# Altium schematic sheet SYZYGY_BOARD_CONN.SchDoc: ARDUINO_SYZGY
size 420 x 297 mm; DrawnBy: Orhun Dabak; Revision: 1.0; SheetNumber: 7; SheetTotal: 8
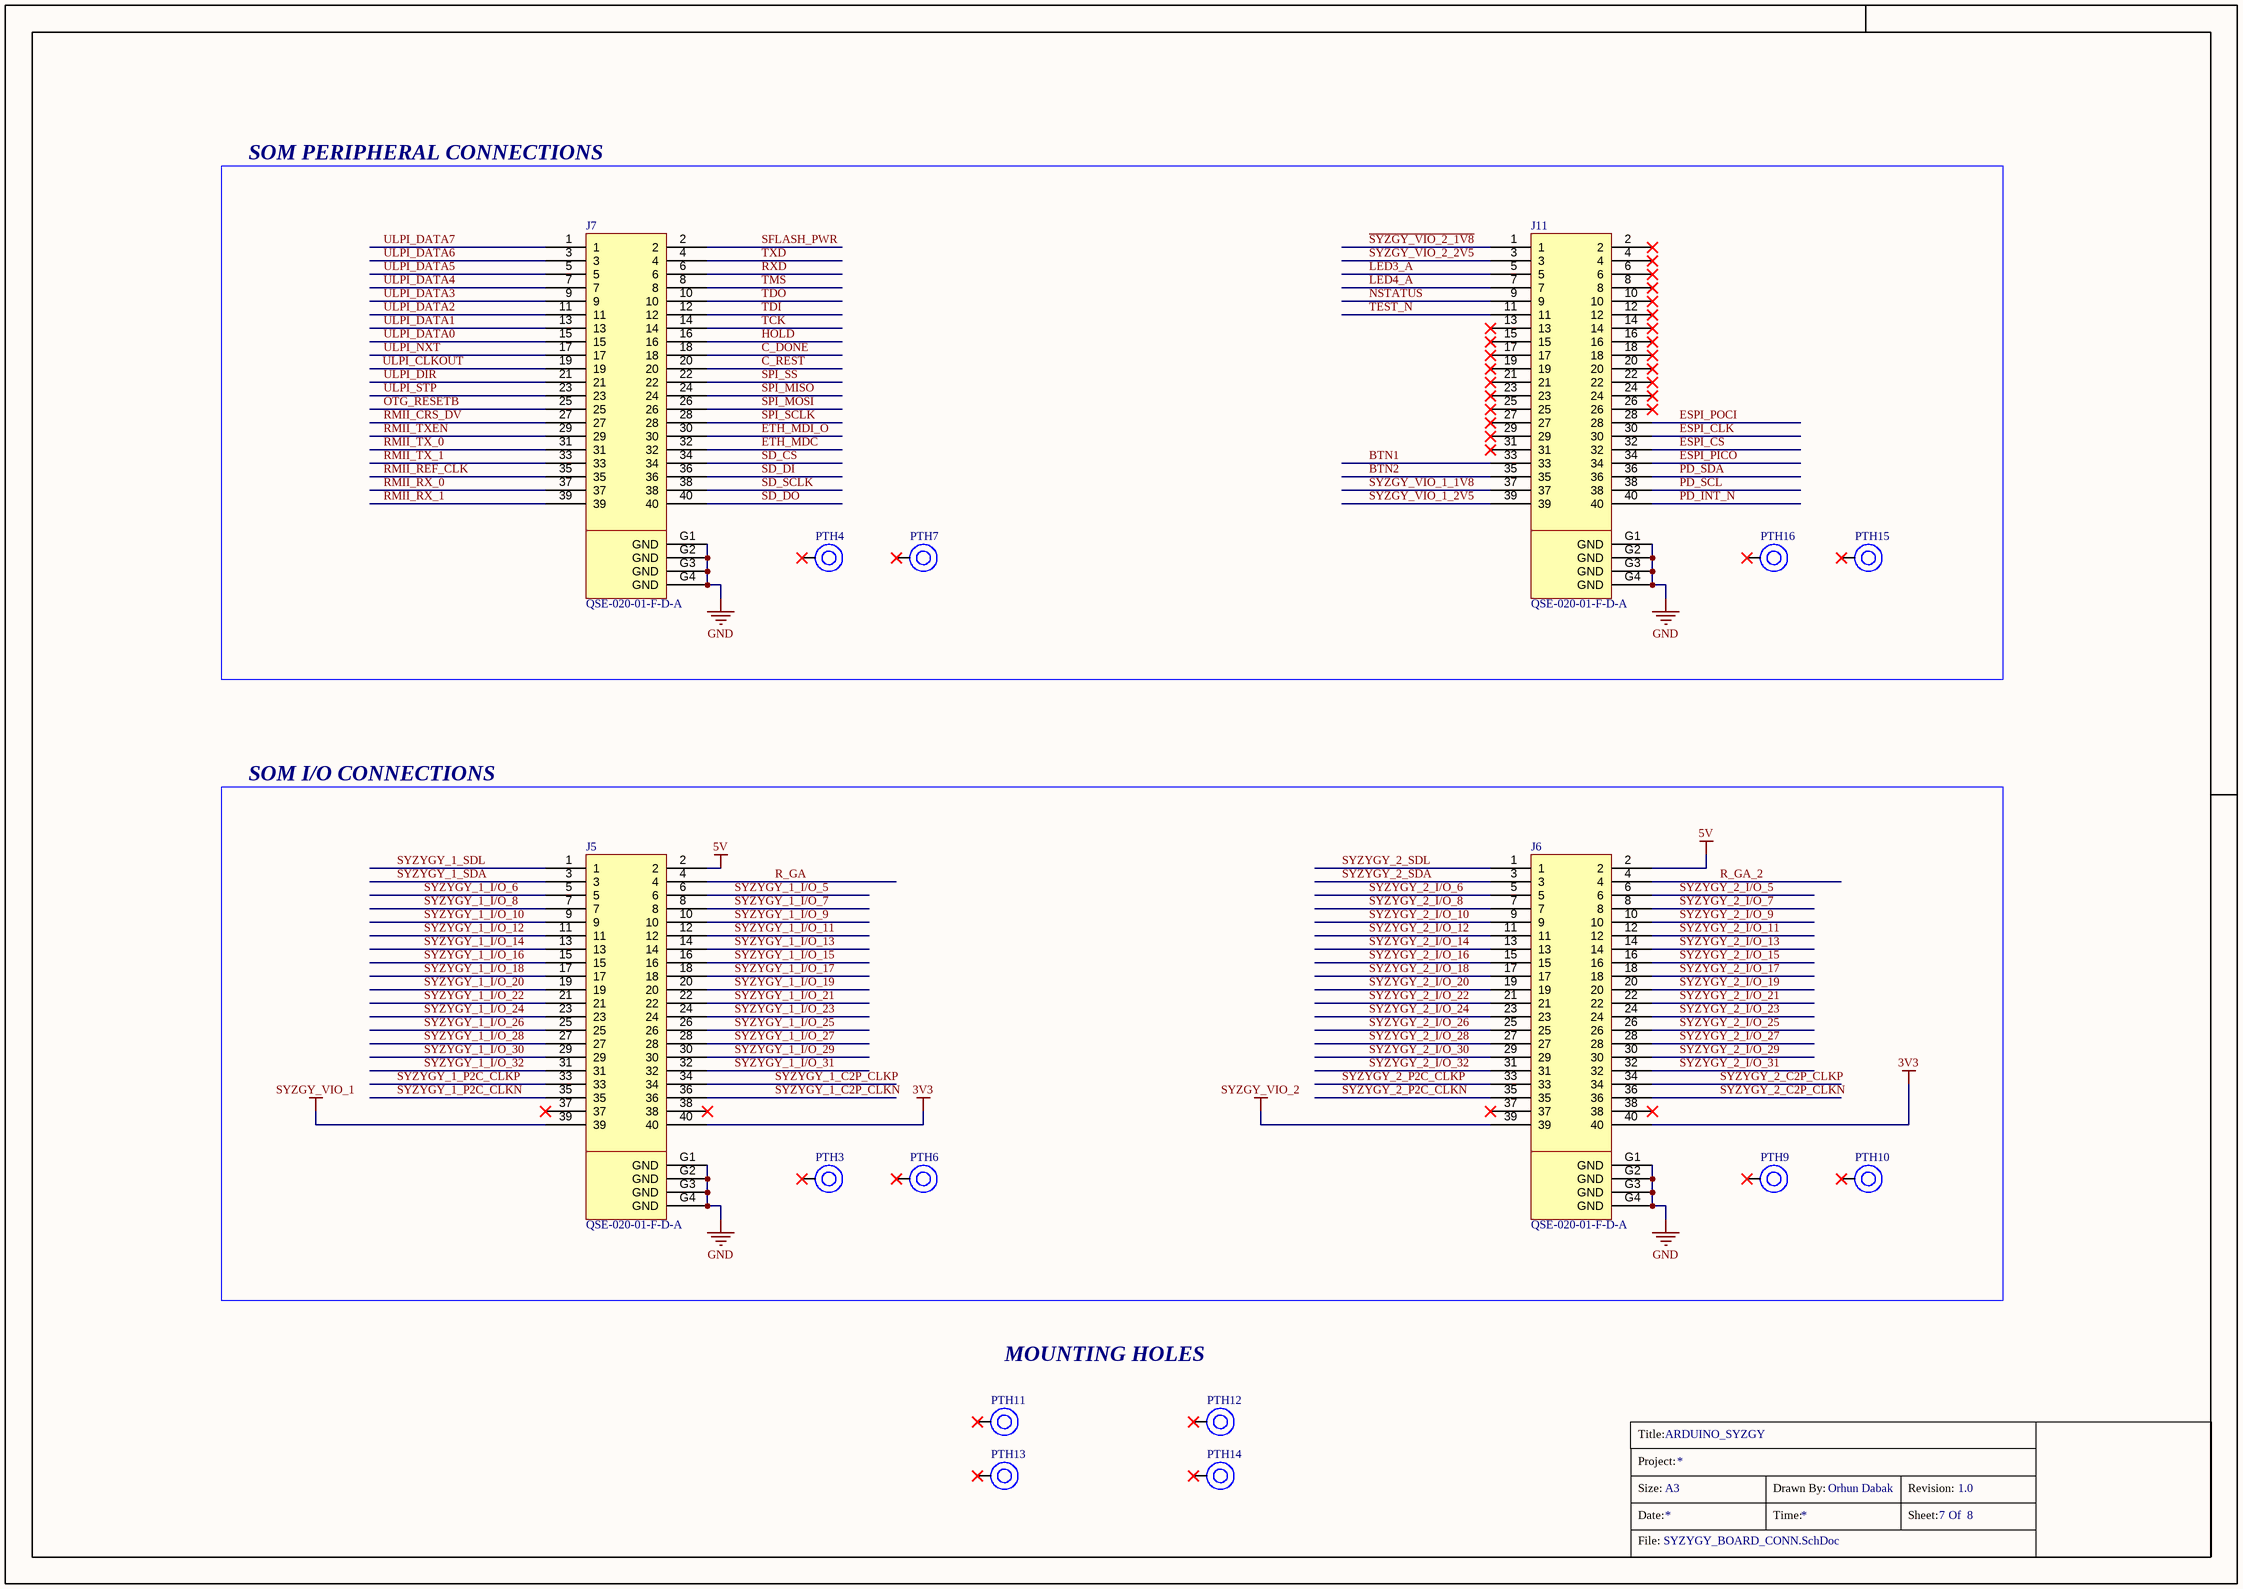
[diagram p0: SYZYGY_BOARD_CONN.SchDoc]

## Parts
?  (no value)  (graphical)
J5  QSE-020-01-F-D-A  [QSE-020-01-F-D-A-Footprint-2]
J6  QSE-020-01-F-D-A  [QSE-020-01-F-D-A-Footprint-2]
J7  QSE-020-01-F-D-A  [QSE-020-01-F-D-A-Footprint-2]
J11  QSE-020-01-F-D-A  [QSE-020-01-F-D-A-Footprint-2]
PTH3  SYZYGY_PCB_Mounting_Hole  [SYZYGY_PCB_Mounting_Hole]  (value not drawn)  (no BOM)
PTH4  SYZYGY_PCB_Mounting_Hole  [SYZYGY_PCB_Mounting_Hole]  (value not drawn)  (mechanical)
PTH6  SYZYGY_PCB_Mounting_Hole  [SYZYGY_PCB_Mounting_Hole]  (value not drawn)  (no BOM)
PTH7  SYZYGY_PCB_Mounting_Hole  [SYZYGY_PCB_Mounting_Hole]  (value not drawn)  (mechanical)
PTH9  SYZYGY_PCB_Mounting_Hole  [SYZYGY_PCB_Mounting_Hole]  (value not drawn)  (mechanical)
PTH10  SYZYGY_PCB_Mounting_Hole  [SYZYGY_PCB_Mounting_Hole]  (value not drawn)  (mechanical)
PTH11  SYZYGY_PCB_Mounting_Hole  [SYZYGY_PCB_Mounting_Hole]  (value not drawn)  (no BOM)
PTH12  SYZYGY_PCB_Mounting_Hole  [SYZYGY_PCB_Mounting_Hole]  (value not drawn)  (no BOM)
PTH13  SYZYGY_PCB_Mounting_Hole  [SYZYGY_PCB_Mounting_Hole]  (value not drawn)  (no BOM)
PTH14  SYZYGY_PCB_Mounting_Hole  [SYZYGY_PCB_Mounting_Hole]  (value not drawn)  (no BOM)
PTH15  SYZYGY_PCB_Mounting_Hole  [SYZYGY_PCB_Mounting_Hole]  (value not drawn)  (no BOM)
PTH16  SYZYGY_PCB_Mounting_Hole  [SYZYGY_PCB_Mounting_Hole]  (value not drawn)  (no BOM)

## Blocks framed on the sheet
SOM PERIPHERAL CONNECTIONS: J7 J11 PTH4 PTH7 PTH15 PTH16
SOM I/O CONNECTIONS: J5 J6 PTH3 PTH6 PTH9 PTH10

## Nets
3V3: J5.40 J6.40
5V: J5.2 J6.2
GND: J5.G1(GND) J5.G2(GND) J5.G3(GND) J5.G4(GND) J6.G1(GND) J6.G2(GND) J6.G3(GND) J6.G4(GND) J7.G1(GND) J7.G2(GND) J7.G3(GND) J7.G4(GND) J11.G1(GND) J11.G2(GND) J11.G3(GND) J11.G4(GND)
SYZGY_VIO_1: J5.39
SYZGY_VIO_2: J6.39
BTN1: J11.33
BTN2: J11.35
C_DONE: J7.18
C_REST: J7.20
ESPI_CLK: J11.30
ESPI_CS: J11.32
ESPI_PICO: J11.34
ESPI_POCI: J11.28
ETH_MDC: J7.32
ETH_MDI_O: J7.30
HOLD: J7.16
LED3_A: J11.5
LED4_A: J11.7
NSTATUS: J11.9
OTG_RESETB: J7.25
PD_INT_N: J11.40
PD_SCL: J11.38
PD_SDA: J11.36
R_GA: J5.4
R_GA_2: J6.4
RMII_CRS_DV: J7.27
RMII_REF_CLK: J7.35
RMII_RX_0: J7.37
RMII_RX_1: J7.39
RMII_TX_0: J7.31
RMII_TX_1: J7.33
RMII_TXEN: J7.29
RXD: J7.6
~{SD_CS}: J7.34
~{SYZGY_VIO_1_1V8}: J11.37
~{SYZGY_VIO_1_2V5}: J11.39
~{SYZGY_VIO_2_1V8}: J11.1
~{SYZGY_VIO_2_2V5}: J11.3
SD_DI: J7.36
SD_DO: J7.40
SD_SCLK: J7.38
SFLASH_PWR: J7.2
SPI_MISO: J7.24
SPI_MOSI: J7.26
SPI_SCLK: J7.28
SPI_SS: J7.22
SYZYGY_1_C2P_CLKN: J5.36
SYZYGY_1_C2P_CLKP: J5.34
SYZYGY_1_I/O_5: J5.6
SYZYGY_1_I/O_6: J5.5
SYZYGY_1_I/O_7: J5.8
SYZYGY_1_I/O_8: J5.7
SYZYGY_1_I/O_9: J5.10
SYZYGY_1_I/O_10: J5.9
SYZYGY_1_I/O_11: J5.12
SYZYGY_1_I/O_12: J5.11
SYZYGY_1_I/O_13: J5.14
SYZYGY_1_I/O_14: J5.13
SYZYGY_1_I/O_15: J5.16
SYZYGY_1_I/O_16: J5.15
SYZYGY_1_I/O_17: J5.18
SYZYGY_1_I/O_18: J5.17
SYZYGY_1_I/O_19: J5.20
SYZYGY_1_I/O_20: J5.19
SYZYGY_1_I/O_21: J5.22
SYZYGY_1_I/O_22: J5.21
SYZYGY_1_I/O_23: J5.24
SYZYGY_1_I/O_24: J5.23
SYZYGY_1_I/O_25: J5.26
SYZYGY_1_I/O_26: J5.25
SYZYGY_1_I/O_27: J5.28
SYZYGY_1_I/O_28: J5.27
SYZYGY_1_I/O_29: J5.30
SYZYGY_1_I/O_30: J5.29
SYZYGY_1_I/O_31: J5.32
SYZYGY_1_I/O_32: J5.31
SYZYGY_1_P2C_CLKN: J5.35
SYZYGY_1_P2C_CLKP: J5.33
SYZYGY_1_SDA: J5.3
SYZYGY_1_SDL: J5.1
SYZYGY_2_C2P_CLKN: J6.36
SYZYGY_2_C2P_CLKP: J6.34
SYZYGY_2_I/O_5: J6.6
SYZYGY_2_I/O_6: J6.5
SYZYGY_2_I/O_7: J6.8
SYZYGY_2_I/O_8: J6.7
SYZYGY_2_I/O_9: J6.10
SYZYGY_2_I/O_10: J6.9
SYZYGY_2_I/O_11: J6.12
SYZYGY_2_I/O_12: J6.11
SYZYGY_2_I/O_13: J6.14
SYZYGY_2_I/O_14: J6.13
SYZYGY_2_I/O_15: J6.16
SYZYGY_2_I/O_16: J6.15
SYZYGY_2_I/O_17: J6.18
SYZYGY_2_I/O_18: J6.17
SYZYGY_2_I/O_19: J6.20
SYZYGY_2_I/O_20: J6.19
SYZYGY_2_I/O_21: J6.22
SYZYGY_2_I/O_22: J6.21
SYZYGY_2_I/O_23: J6.24
SYZYGY_2_I/O_24: J6.23
SYZYGY_2_I/O_25: J6.26
SYZYGY_2_I/O_26: J6.25
SYZYGY_2_I/O_27: J6.28
SYZYGY_2_I/O_28: J6.27
SYZYGY_2_I/O_29: J6.30
SYZYGY_2_I/O_30: J6.29
SYZYGY_2_I/O_31: J6.32
SYZYGY_2_I/O_32: J6.31
SYZYGY_2_P2C_CLKN: J6.35
SYZYGY_2_P2C_CLKP: J6.33
SYZYGY_2_SDA: J6.3
SYZYGY_2_SDL: J6.1
TCK: J7.14
TDI: J7.12
TDO: J7.10
TEST_N: J11.11
TMS: J7.8
TXD: J7.4
ULPI_CLKOUT: J7.19
ULPI_DATA0: J7.15
ULPI_DATA1: J7.13
ULPI_DATA2: J7.11
ULPI_DATA3: J7.9
ULPI_DATA4: J7.7
ULPI_DATA5: J7.5
ULPI_DATA6: J7.3
ULPI_DATA7: J7.1
ULPI_DIR: J7.21
ULPI_NXT: J7.17
ULPI_STP: J7.23

Not connected (* = marked no-connect by the designer): J5 37* 38*; J6 37* 38*; J11 2* 4* 6* 8* 10* 12* 13* 14* 15* 16* 17* 18* 19* 20* 21* 22* 23* 24* 25* 26* 27* 29* 31*; PTH3 1*; PTH4 1*; PTH6 1*; PTH7 1*; PTH9 1*; PTH10 1*; PTH11 1*; PTH12 1*; PTH13 1*; PTH14 1*; PTH15 1*; PTH16 1*

## Notes on the sheet
- MOUNTING HOLES
- Title:
- Project:
- Size:
- Date:
- File:
- A3
- Time:
- Drawn By:
- Sheet:
- Revision:
- Of

## Library data of the parts
? = Title_Block
J5-J7 J11 = CMP-002-00073-2_2: Conn High Speed Socket Strip SKT 40 POS 0.8mm Solder ST SMD Tray